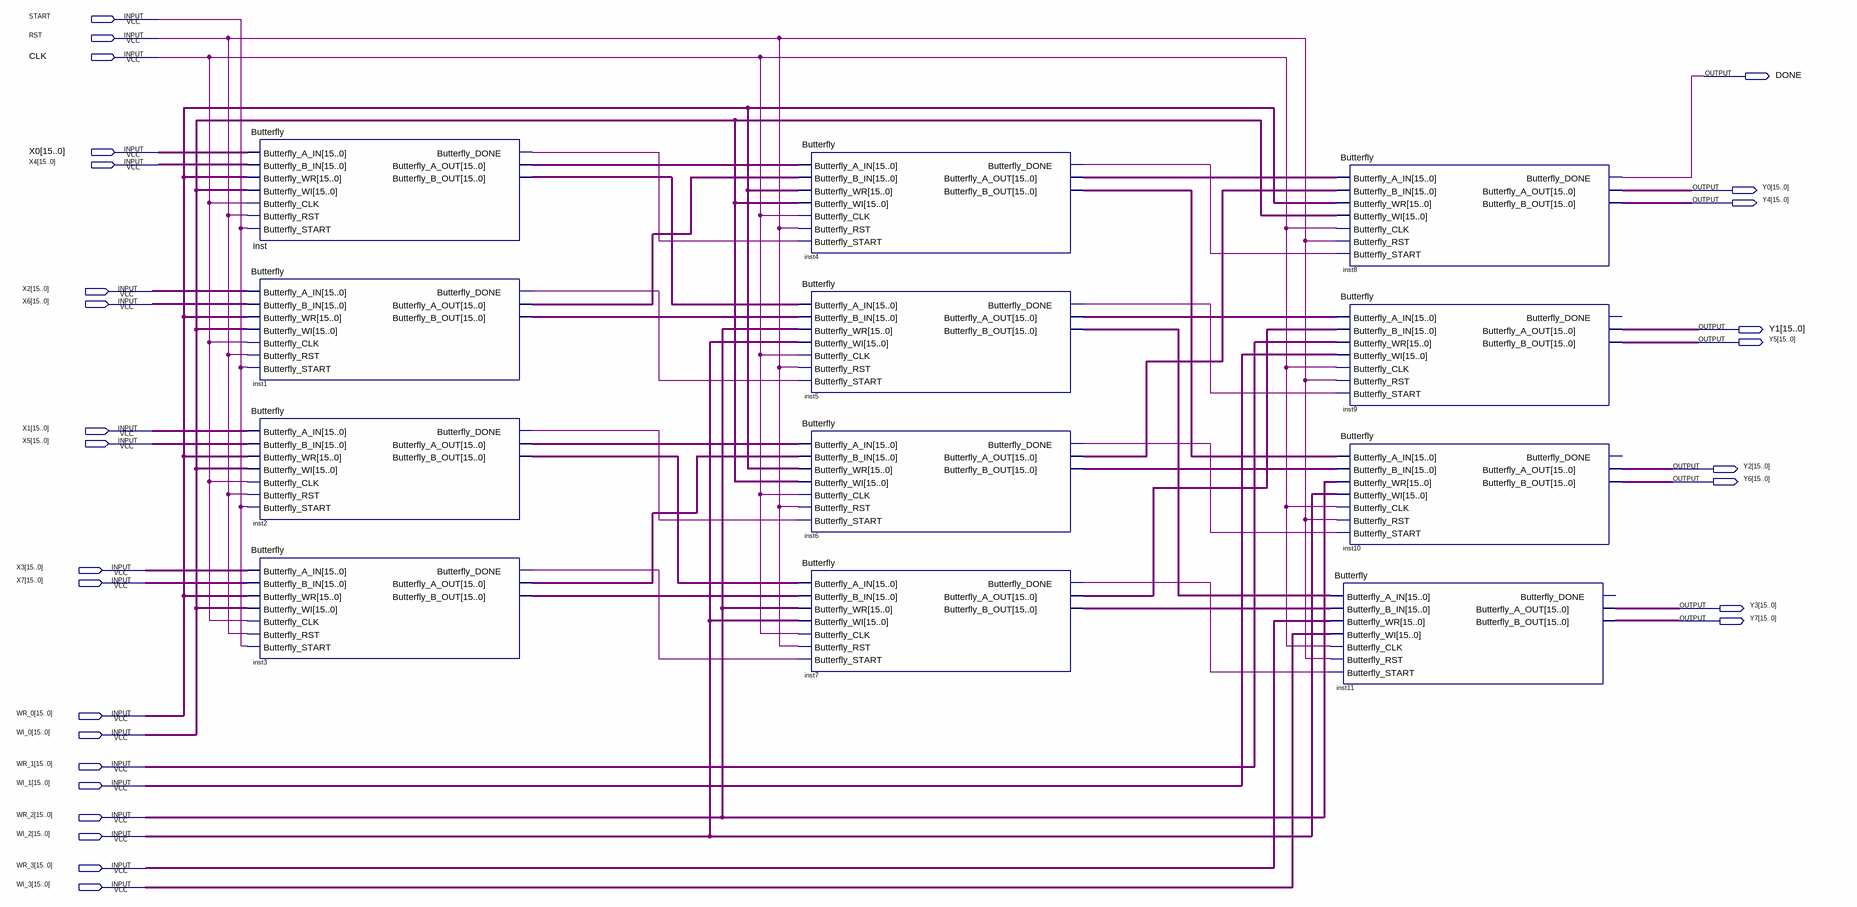
[diagram p0: schematic sheet]
// Quartus schematic FFT_8.bdf as structural Verilog: 12 symbols, 28 pins
module FFT_8 (
  input  START,
  input  RST,
  input  CLK,
  input  [15:0] X0,
  input  [15:0] X4,
  input  [15:0] X2,
  input  [15:0] X6,
  input  [15:0] X1,
  input  [15:0] X5,
  input  [15:0] X3,
  input  [15:0] X7,
  input  [15:0] WR_0,
  input  [15:0] WI_0,
  input  [15:0] WR_1,
  input  [15:0] WI_1,
  input  [15:0] WR_2,
  input  [15:0] WI_2,
  input  [15:0] WR_3,
  input  [15:0] WI_3,
  output DONE,
  output [15:0] Y0,
  output [15:0] Y4,
  output [15:0] Y1,
  output [15:0] Y5,
  output [15:0] Y2,
  output [15:0] Y6,
  output [15:0] Y3,
  output [15:0] Y7
);

  wire inst1_butterfly_done, inst2_butterfly_done, inst3_butterfly_done, inst4_butterfly_done,
       inst5_butterfly_done, inst6_butterfly_done, inst7_butterfly_done, inst_butterfly_done;
  wire [15:0] inst1_butterfly_a_out, inst1_butterfly_b_out, inst2_butterfly_a_out, inst2_butterfly_b_out,
       inst3_butterfly_a_out, inst3_butterfly_b_out, inst4_butterfly_a_out, inst4_butterfly_b_out,
       inst5_butterfly_a_out, inst5_butterfly_b_out, inst6_butterfly_a_out, inst6_butterfly_b_out,
       inst7_butterfly_a_out, inst7_butterfly_b_out, inst_butterfly_a_out, inst_butterfly_b_out;

  Butterfly inst (
    .Butterfly_A_IN(X0), .Butterfly_B_IN(X4), .Butterfly_WR(WR_0), .Butterfly_WI(WI_0), .Butterfly_CLK(CLK),
    .Butterfly_RST(RST), .Butterfly_START(START), .Butterfly_DONE(inst_butterfly_done),
    .Butterfly_A_OUT(inst_butterfly_a_out), .Butterfly_B_OUT(inst_butterfly_b_out));
  Butterfly inst1 (
    .Butterfly_A_IN(X2), .Butterfly_B_IN(X6), .Butterfly_WR(WR_0), .Butterfly_WI(WI_0), .Butterfly_CLK(CLK),
    .Butterfly_RST(RST), .Butterfly_START(START), .Butterfly_DONE(inst1_butterfly_done),
    .Butterfly_A_OUT(inst1_butterfly_a_out), .Butterfly_B_OUT(inst1_butterfly_b_out));
  Butterfly inst2 (
    .Butterfly_A_IN(X1), .Butterfly_B_IN(X5), .Butterfly_WR(WR_0), .Butterfly_WI(WI_0), .Butterfly_CLK(CLK),
    .Butterfly_RST(RST), .Butterfly_START(START), .Butterfly_DONE(inst2_butterfly_done),
    .Butterfly_A_OUT(inst2_butterfly_a_out), .Butterfly_B_OUT(inst2_butterfly_b_out));
  Butterfly inst3 (
    .Butterfly_A_IN(X3), .Butterfly_B_IN(X7), .Butterfly_WR(WR_0), .Butterfly_WI(WI_0), .Butterfly_CLK(CLK),
    .Butterfly_RST(RST), .Butterfly_START(START), .Butterfly_DONE(inst3_butterfly_done),
    .Butterfly_A_OUT(inst3_butterfly_a_out), .Butterfly_B_OUT(inst3_butterfly_b_out));
  Butterfly inst4 (
    .Butterfly_A_IN(inst_butterfly_a_out), .Butterfly_B_IN(inst1_butterfly_a_out), .Butterfly_WR(WR_0),
    .Butterfly_WI(WI_0), .Butterfly_CLK(CLK), .Butterfly_RST(RST), .Butterfly_START(inst_butterfly_done),
    .Butterfly_DONE(inst4_butterfly_done), .Butterfly_A_OUT(inst4_butterfly_a_out),
    .Butterfly_B_OUT(inst4_butterfly_b_out));
  Butterfly inst5 (
    .Butterfly_A_IN(inst_butterfly_b_out), .Butterfly_B_IN(inst1_butterfly_b_out), .Butterfly_WR(WR_2),
    .Butterfly_WI(WI_2), .Butterfly_CLK(CLK), .Butterfly_RST(RST), .Butterfly_START(inst1_butterfly_done),
    .Butterfly_DONE(inst5_butterfly_done), .Butterfly_A_OUT(inst5_butterfly_a_out),
    .Butterfly_B_OUT(inst5_butterfly_b_out));
  Butterfly inst6 (
    .Butterfly_A_IN(inst2_butterfly_a_out), .Butterfly_B_IN(inst3_butterfly_a_out), .Butterfly_WR(WR_0),
    .Butterfly_WI(WI_0), .Butterfly_CLK(CLK), .Butterfly_RST(RST), .Butterfly_START(inst2_butterfly_done),
    .Butterfly_DONE(inst6_butterfly_done), .Butterfly_A_OUT(inst6_butterfly_a_out),
    .Butterfly_B_OUT(inst6_butterfly_b_out));
  Butterfly inst7 (
    .Butterfly_A_IN(inst2_butterfly_b_out), .Butterfly_B_IN(inst3_butterfly_b_out), .Butterfly_WR(WR_2),
    .Butterfly_WI(WI_2), .Butterfly_CLK(CLK), .Butterfly_RST(RST), .Butterfly_START(inst3_butterfly_done),
    .Butterfly_DONE(inst7_butterfly_done), .Butterfly_A_OUT(inst7_butterfly_a_out),
    .Butterfly_B_OUT(inst7_butterfly_b_out));
  Butterfly inst8 (
    .Butterfly_A_IN(inst4_butterfly_a_out), .Butterfly_B_IN(inst6_butterfly_a_out), .Butterfly_WR(WR_0),
    .Butterfly_WI(WI_0), .Butterfly_CLK(CLK), .Butterfly_RST(RST), .Butterfly_START(inst4_butterfly_done),
    .Butterfly_DONE(DONE), .Butterfly_A_OUT(Y0), .Butterfly_B_OUT(Y4));
  Butterfly inst9 (
    .Butterfly_A_IN(inst5_butterfly_a_out), .Butterfly_B_IN(inst7_butterfly_a_out), .Butterfly_WR(WR_1),
    .Butterfly_WI(WI_1), .Butterfly_CLK(CLK), .Butterfly_RST(RST), .Butterfly_START(inst5_butterfly_done),
    .Butterfly_A_OUT(Y1), .Butterfly_B_OUT(Y5));  // open: Butterfly_DONE
  Butterfly inst10 (
    .Butterfly_A_IN(inst4_butterfly_b_out), .Butterfly_B_IN(inst6_butterfly_b_out), .Butterfly_WR(WR_2),
    .Butterfly_WI(WI_2), .Butterfly_CLK(CLK), .Butterfly_RST(RST), .Butterfly_START(inst6_butterfly_done),
    .Butterfly_A_OUT(Y2), .Butterfly_B_OUT(Y6));  // open: Butterfly_DONE
  Butterfly inst11 (
    .Butterfly_A_IN(inst5_butterfly_b_out), .Butterfly_B_IN(inst7_butterfly_b_out), .Butterfly_WR(WR_3),
    .Butterfly_WI(WI_3), .Butterfly_CLK(CLK), .Butterfly_RST(RST), .Butterfly_START(inst7_butterfly_done),
    .Butterfly_A_OUT(Y3), .Butterfly_B_OUT(Y7));  // open: Butterfly_DONE
endmodule
